# EAGLE design hub-i-proto-pcbant01 (EAGLE 7.2.0)
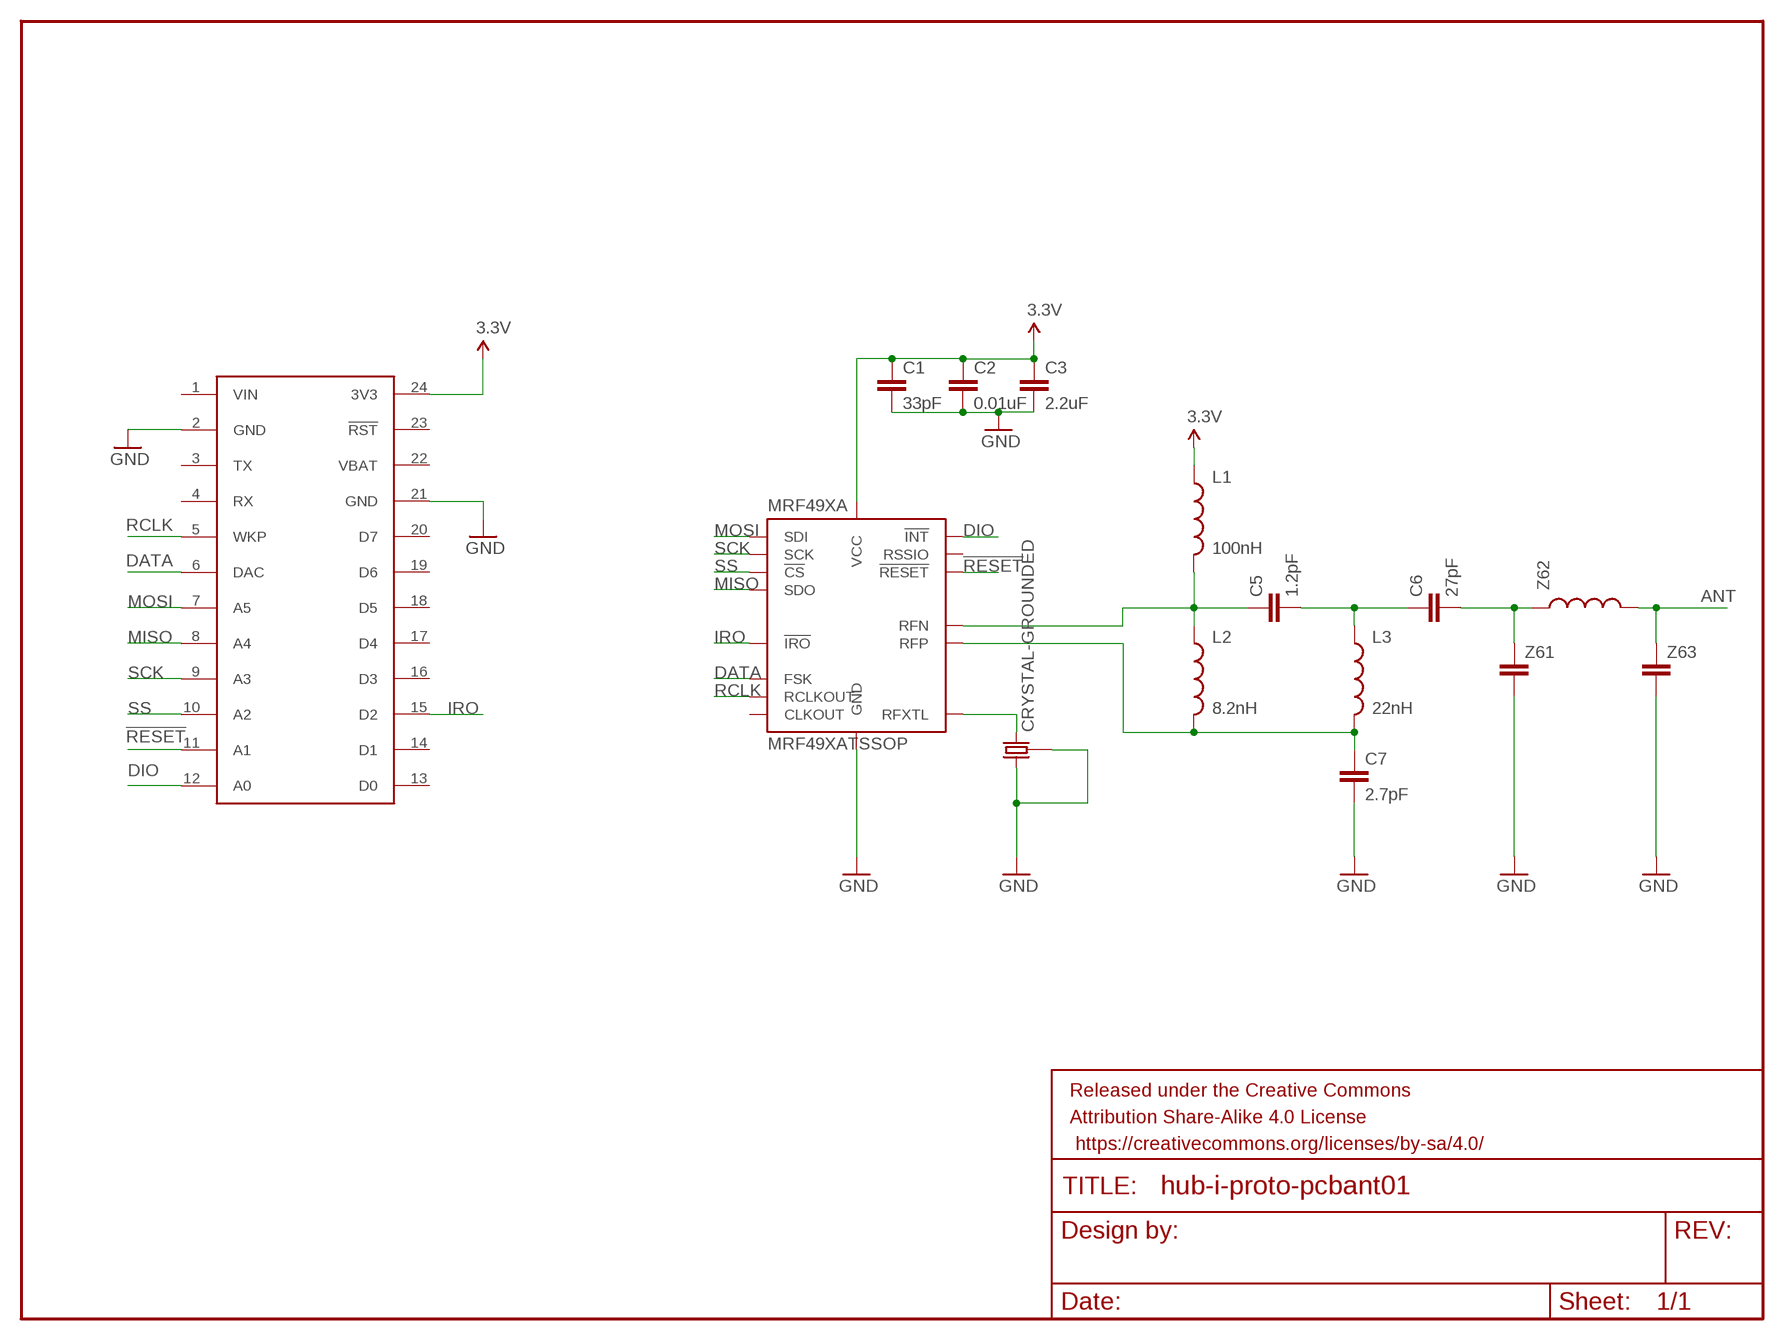
[diagram p0: schematic, sheet 1]

## Parts
C1  33pF  CAP0603-CAP  [0603-CAP]
C2  0.01uF  CAP0603-CAP  [0603-CAP]
C3  2.2uF  CAP0603-CAP  [0603-CAP]
C5  1.2pF  CAP0603-CAP  [0603-CAP]
C6  27pF  CAP0603-CAP  [0603-CAP]
C7  2.7pF  CAP0603-CAP  [0603-CAP]
CORE  SPARK_CORECORE  [SPARK_CORE]
FRAME1  FRAME-LETTER  [CREATIVE_COMMONS]
L1  100nH  INDUCTOR0603  [0603]
L2  8.2nH  INDUCTOR0603  [0603]
L3  22nH  INDUCTOR0603  [0603]
MRF49XA  MRF49XATSSOP  [TSSOP16]
Y1  CRYSTAL-GROUNDED  [CRYSTAL-SMD-5X3]
Z61  CAP0603-CAP  [0603-CAP]
Z62  INDUCTOR0603  [0603]
Z63  CAP0603-CAP  [0603-CAP]

## Nets
3.3V: C1.1 C2.1 C3.1 CORE.24(3V3) L1.1 MRF49XA.14(VCC)
!RESET: CORE.11(A1) MRF49XA.10(!RESET)
ANT: Z62.2 Z63.1
DATA: CORE.6(DAC) MRF49XA.6(FSK)
DIO: CORE.12(A0) MRF49XA.16(!INT)
GND: C1.2 C2.2 C3.2 C7.2 CORE.2(GND) CORE.21(GND) MRF49XA.11(GND) Y1.2 Y1.3 Y1.4 Z61.2 Z63.2
IRO: CORE.15(D2) MRF49XA.5(!IRO)
MISO: CORE.8(A4) MRF49XA.4(SDO)
MOSI: CORE.7(A5) MRF49XA.1(SDI)
N$1: C5.2 C6.1 L3.1
N$2: MRF49XA.9(RFXTL) Y1.1
N$3: C5.1 L1.2 L2.1 MRF49XA.13(RFN)
N$4: C7.1 L2.2 L3.2 MRF49XA.12(RFP)
N$5: C6.2 Z61.1 Z62.1
RCLK: CORE.5(WKP) MRF49XA.7(RCLKOUT)
SCK: CORE.9(A3) MRF49XA.2(SCK)
SS: CORE.10(A2) MRF49XA.3(!CS)
Unconnected: CORE.3(TX) CORE.4(RX) CORE.13(D0) CORE.14(D1) CORE.16(D3) CORE.17(D4) CORE.18(D5) CORE.19(D6) CORE.20(D7) CORE.23(!RST) MRF49XA.8(CLKOUT) MRF49XA.15(RSSIO)

## Power pins joined to a net without a drawn wire
VBAT: CORE.22(VBAT)
VIN: CORE.1(VIN)

## Library data of the parts
C1-C3 C5-C7 Z61 Z63 = SparkFun-Passives:CAP: Capacitor Standard 0603 ceramic capacitor, and 0.1" leaded capacitor.
CORE = Spark:SPARK_CORE
FRAME1 = SparkFun-Aesthetics:FRAME-LETTER: Schematic Frame Standard 8.5x11 US Letter frame
L1-L3 Z62 = SparkFun-Passives:INDUCTOR: Inductors Basic Inductor/Choke - 0603 and 1206. Footprints are not proven and vary greatly between part numbers. SRN6045- 33uH, 20% 1.4A SDR0403-560KL - 56uH, 10%, 500mA RMS/740mA peak
MRF49XA = AutomateGreen:MRF49XA: Microchip MRF49XA ISM Band Sub-GHz RF Transceiver (433 MHz, 868 MHz and 915 MHz). http://ww1.microchip.com/downloads/en/DeviceDoc/70590C.pdf
Y1 = AutomateGreen:CRYSTAL-GROUNDED

## Board
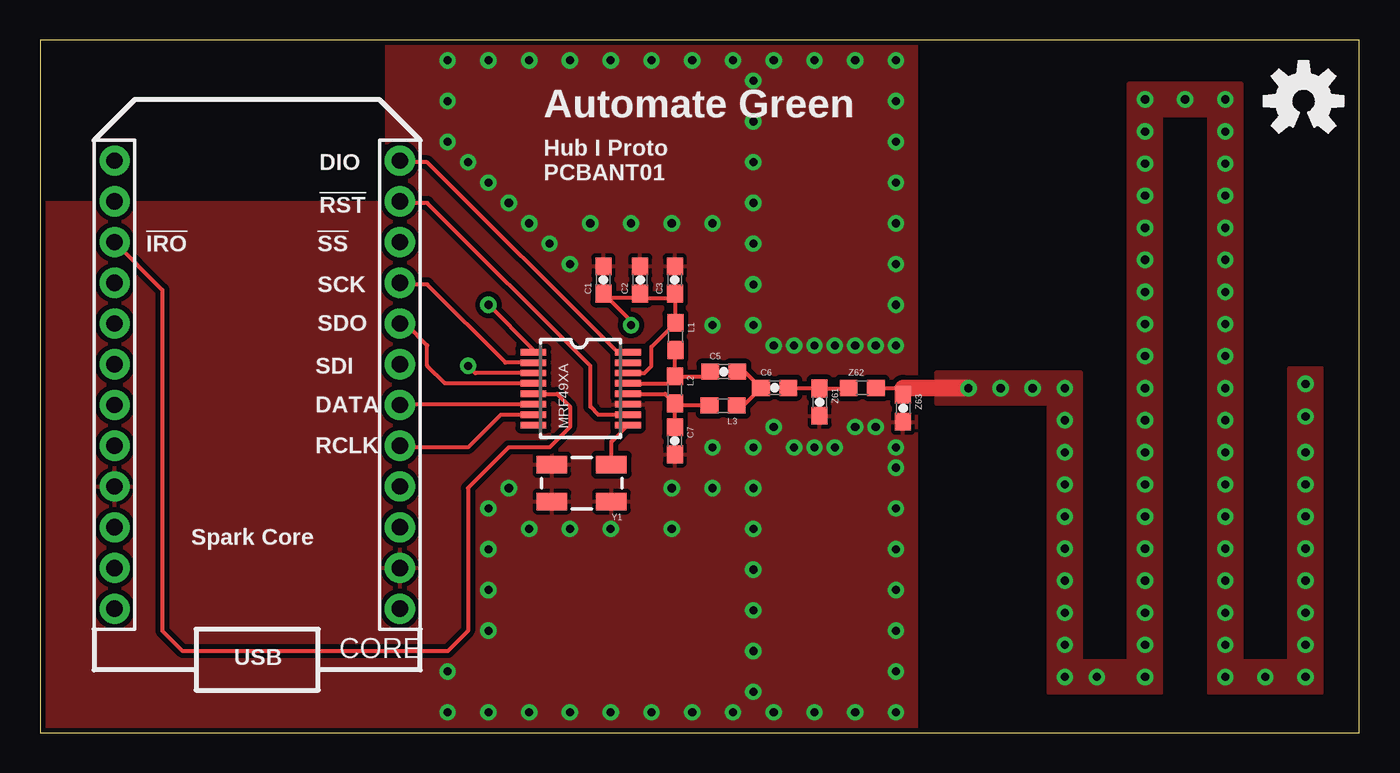
[diagram p1: board, top side]
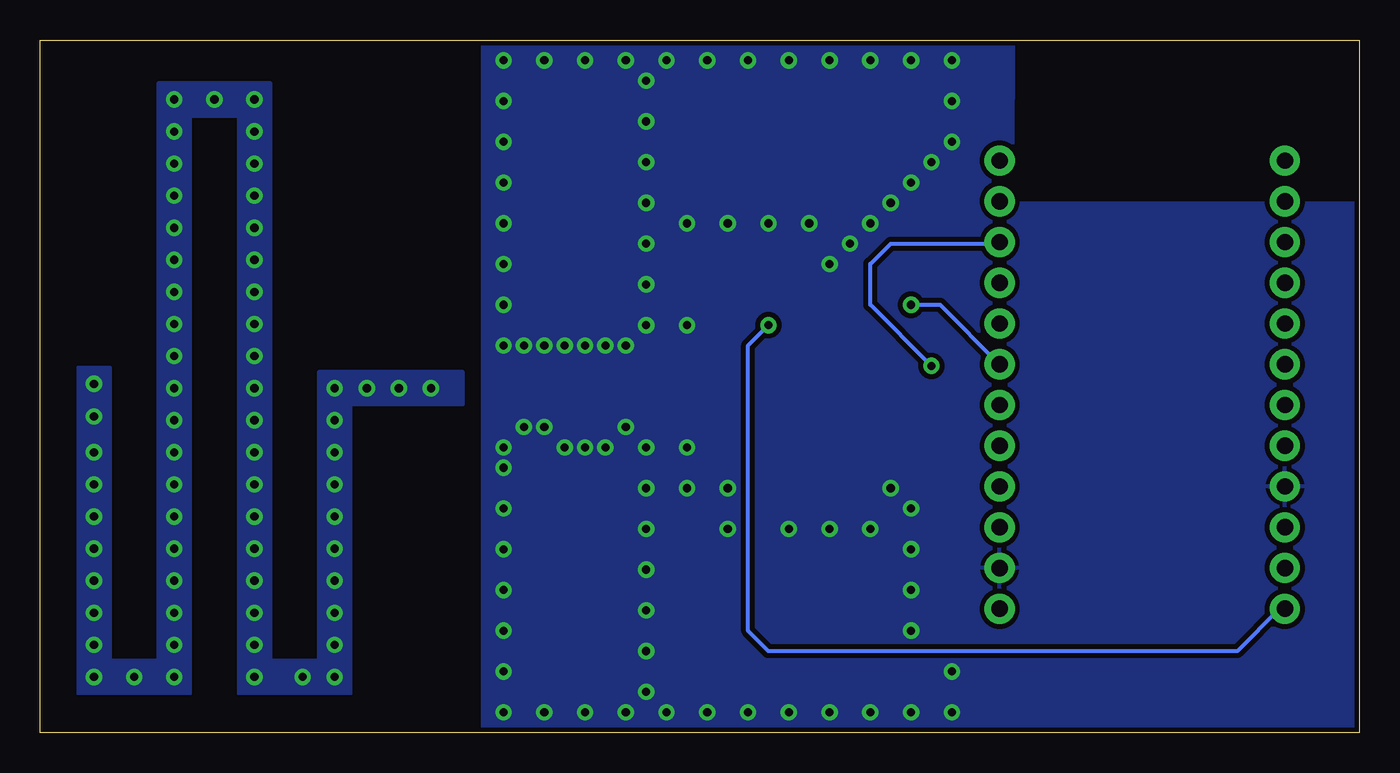
[diagram p2: board, bottom side, seen from below]

Size 82.22 x 43.17 mm. Coordinates in mm from the lower left corner, seen from the top.
Outline: 0,0 82.22,0 82.22,43.17 0,43.17 0,0
Copper layers (1*16): Top 0.035mm / dielectric 1.5mm / Bottom 0.035mm
Design rules "SparkFun-2-layer": minimum track width 7mil, minimum drill 15mil, track to track 8mil, track to pad 8mil, pad to pad 8mil, via to via 8mil, smd to smd 8mil, copper to edge 8mil, drill to drill 8mil, minimum pad ring 12mil, minimum via ring 10mil, stop-mask expansion 4mil, vias tented up to drill 20mil, thermal gap 10mil

### Footprints (pad centres in the part's own frame; a part is rotated, then mirrored left to right if it is on the bottom)
0603-CAP = smd 1.1 x 1: 1 -0.85,0; 2 0.85,0
SPARK_CORE = drill 1.016 pad 1.88: 1 -8.89,13.97; 2 -8.89,11.43; 3 -8.89,8.89; 4 -8.89,6.35; 5 -8.89,3.81; 6 -8.89,1.27; 7 -8.89,-1.27; 8 -8.89,-3.81; 9 -8.89,-6.35; 10 -8.89,-8.89; 11 -8.89,-11.43; 12 -8.89,-13.97; 13 8.89,-13.97; 14 8.89,-11.43; 15 8.89,-8.89; 16 8.89,-6.35; 17 8.89,-3.81; 18 8.89,-1.27; 19 8.89,1.27; 20 8.89,3.81; 21 8.89,6.35; 22 8.89,8.89; 23 8.89,11.43; 24 8.89,13.97
0603 = smd 1.1 x 1: 1 -0.85,0; 2 0.85,0
TSSOP16 = smd 0.4 x 1.6: 1 -2.225,-2.85; 2 -1.575,-2.85; 3 -0.925,-2.85; 4 -0.275,-2.85; 5 0.375,-2.85; 6 1.025,-2.85; 7 1.675,-2.85; 8 2.325,-2.85; 9 2.325,3.05; 10 1.675,3.05; 11 1.025,3.05; 12 0.375,3.05; 13 -0.275,3.05; 14 -0.925,3.05; 15 -1.575,3.05; 16 -2.225,3.05
CRYSTAL-SMD-5X3 = smd 1.9 x 1.1: 1 -1.85,-1.15; 2 1.85,-1.15; 3 1.85,1.15; 4 -1.85,1.15

### Placement (x,y rotation side)
C1  35.11,28.22 90 top
C2  37.4,28.22 90 top
C3  39.56,28.22 90 top
C5  42.6,22.51 0 top
C6  45.78,21.49 0 top
C7  39.56,18.19 270 top
CORE  13.53,21.69 180 top
FRAME1  29.21,-10.16 0 top  (outside the outline)
L1  39.6,24.7 270 top
L2  39.56,21.36 270 top
L3  42.57,20.39 180 top
MRF49XA  33.59,21.49 270 top
U$2  [OSHW-LOGO-M]  78.74,39.37 0 top
Y1  33.76,15.55 180 top
Z61  48.57,20.6 270 top
Z62  51.24,21.49 0 top
Z63  53.78,20.22 270 top

### Tracks (layer width: path | path; a pad name or v marks a point on that pad's centre or on a via)
3.3V  (via drill 0.51)
  Top 0.254: 37.69,27.08 C2.1 | 37.69,27.08 35.41,27.08 C1.1 36.83,25.65 v36.83,25.4 | 37.69,27.08 39.26,27.08 C3.1 39.6,27.33 L1.1 | MRF49XA.14 37.66,22.41 38.1,22.86 38.1,24.05 L1.1 | 39.45,25.4 L1.1
  Bottom 0.254: CORE.24 4.98,7.72 7.62,5.08 36.83,5.08 38.1,6.35 38.1,24.13 v36.83,25.4
!RESET
  Top 0.254: MRF49XA.10 34.8,19.82 34.29,20.32 34.29,22.86 24.13,33.02 22.52,33.02 CORE.11
ANT  (via drill 0.51)
  Top 0.254: Z62.2 53.78,21.49 Z63.1
  Top 1.016: 53.78,21.49 57.84,21.49 v57.86,21.47
  other vias: 68.86,21.47 59.86,21.47 61.86,21.47 63.86,21.47 63.86,19.47 63.86,17.47 63.86,15.47 63.86,13.47 63.86,11.47 63.86,9.47 63.86,7.47 63.86,5.47 63.86,3.47 65.86,3.47 68.86,3.47 68.86,5.47 68.86,7.47 68.86,9.47 68.86,11.47 68.86,13.47 68.86,15.47 68.86,17.47 68.86,19.47 68.86,23.47 68.86,25.47 68.86,27.47 68.86,29.47 68.86,31.47 68.86,33.47 68.86,35.47 68.86,37.47 68.86,39.47 71.36,39.47 73.86,39.47 73.86,37.47 73.86,35.47 73.86,33.47 73.86,31.47 73.86,29.47 73.86,27.47 73.86,25.47 73.86,23.47 73.86,21.47 73.86,19.47 73.86,17.47 73.86,15.47 73.86,13.47 73.86,11.47 73.86,9.47 73.86,7.47 73.86,5.47 73.86,3.47 76.36,3.47 78.86,3.47 78.86,5.47 78.86,7.47 78.86,9.47 78.86,11.47 78.86,13.47 78.86,15.47 78.86,17.47 78.86,21.74 78.86,19.71
  pour Top: 79.86,22.74 79.86,2.47 72.86,2.47 72.86,38.47 69.86,38.47 69.86,2.47 62.86,2.47 62.86,20.47 55.86,20.47 55.86,22.47 64.86,22.47 64.86,4.47 67.86,4.47 67.86,40.47 74.86,40.47 74.86,4.47 77.86,4.47 77.86,22.74
  pour Bottom: 79.86,22.74 79.86,2.47 72.86,2.47 72.86,38.47 69.86,38.47 69.86,2.47 62.86,2.47 62.86,20.47 55.86,20.47 55.86,22.47 64.86,22.47 64.86,4.47 67.86,4.47 67.86,40.47 74.86,40.47 74.86,4.47 77.86,4.47 77.86,22.74
DATA
  Top 0.254: MRF49XA.6 22.46,20.46 CORE.6
DIO
  Top 0.254: MRF49XA.16 35.98,23.71 24.13,35.56 22.52,35.56 CORE.12
GND  (via drill 0.51)
  other vias: 53.34,41.91 53.34,39.37 53.34,36.83 53.34,34.29 53.34,31.75 53.34,29.21 53.34,26.67 53.34,24.13 52.07,24.13 50.8,24.13 49.53,24.13 48.26,24.13 46.99,24.13 45.72,24.13 44.45,27.94 44.45,33.02 44.45,35.56 44.45,38.1 44.45,40.64 45.72,41.91 48.26,41.91 50.8,41.91 53.34,16.51 53.34,13.97 53.34,11.43 53.34,8.89 53.34,6.35 53.34,3.81 53.34,1.27 50.8,1.27 48.26,1.27 45.72,1.27 43.18,1.27 40.64,1.27 38.1,1.27 35.56,1.27 33.02,1.27 30.48,1.27 27.94,1.27 44.45,12.7 44.45,10.16 44.45,7.62 44.45,5.08 44.45,2.54 25.4,41.91 27.94,41.91 30.48,41.91 33.02,41.91 35.56,41.91 38.1,41.91 40.64,41.91 43.18,41.91 44.45,25.4 25.4,39.37 25.4,36.83 53.34,17.78 52.07,19.05 50.8,19.05 49.53,17.78 48.26,17.78 46.99,17.78 45.72,19.05 44.45,17.78 44.45,15.24 26.67,35.56 27.94,34.29 29.21,33.02 30.48,31.75 31.75,30.48 33.02,29.21 25.4,1.27 25.4,3.81 27.94,6.35 27.94,8.89 27.94,11.43 27.94,13.97 29.21,15.24 30.48,12.7 33.02,12.7 35.56,12.7 39.37,12.7 39.37,15.24 41.91,15.24 41.91,17.78 44.45,30.48 41.91,25.4 41.91,31.75 39.37,31.75 36.83,31.75 34.29,31.75
  pour Top (isolate 0.305): 0,0 54.61,0 54.61,43.18 24.13,43.18 21.59,43.18 21.59,33.02 0,33.02
  pour Bottom (isolate 0.305): 0,0 54.61,0 54.61,43.18 24.13,43.18 21.59,43.18 21.59,33.02 0,33.02
IRO
  Top 0.254: MRF49XA.5 32.23,21.11 33.02,20.32 33.02,19.05 31.75,17.78 29.21,17.78 26.67,15.24 26.67,6.35 25.4,5.08 8.89,5.08 7.62,6.35 7.62,27.6 CORE.15
MISO
  Top 0.254: MRF49XA.4 25.23,21.77 24.13,22.86 24.13,24.13 22.86,25.4 22.52,25.4 CORE.8
MOSI  (via drill 0.51)
  Top 0.254: MRF49XA.1 30.74,23.87 v27.94,26.67
  Bottom 0.254: v27.94,26.67 26.13,26.67 CORE.7
N$1
  Top 0.254: C5.2 43.91,22.51 C6.1 43.76,20.32 43.18,20.32 43.25,20.39 L3.1
N$2
  Top 0.254: Y1.1 35.6,18.13 MRF49XA.9
N$3
  Top 0.254: L2.1 41.46,22.21 C5.1 | MRF49XA.13 39.11,21.77 L2.1 | L2.1 39.56,23.81 L1.2
N$4
  Top 0.254: L3.2 39.68,20.39 L2.2 | C7.1 L2.2 | MRF49XA.12 38.95,21.11 L2.2
N$5
  Top 0.254: 48.54,21.48 Z61.1 | Z61.1 50.35,21.45 Z62.1 | C6.2 48.53,21.49 Z61.1
RCLK
  Top 0.254: MRF49XA.7 28.7,19.82 26.67,17.78 22.52,17.78 CORE.5
SCK
  Top 0.254: MRF49XA.2 29,23.07 24.13,27.94 22.52,27.94 CORE.9
SS  (via drill 0.51)
  Top 0.254: MRF49XA.3 27.11,22.41 v26.67,22.86
  Bottom 0.254: v26.67,22.86 30.48,26.67 30.48,29.21 29.21,30.48 22.52,30.48 CORE.10

### Text on the board
tPlace: Automate Green | DIO | Hub I Proto / PCBANT01 | !RST | !IRO | !SS | SCK | SDO | SDI | DATA | RCLK | Spark Core | USB